# EAGLE schematic Motherboard (EAGLE 6.5.0)

## Sheet 1 of 7: Power
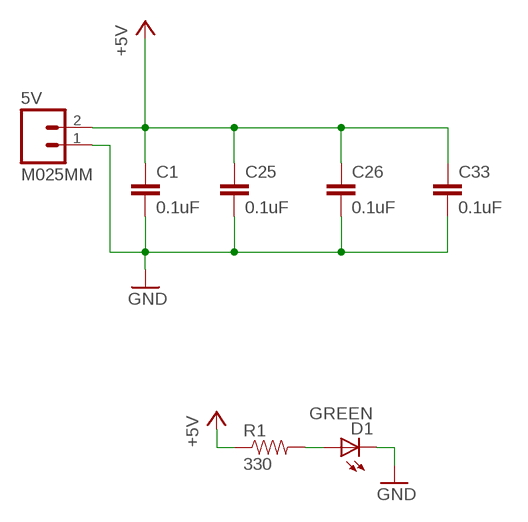
[diagram p0: schematic, sheet 1]

### Parts
5V  M025MM  [SCREWTERMINAL-5MM-2]
C1  0.1uF  CAP1206  [1206]
C25  0.1uF  CAP1206  [1206]
C26  0.1uF  CAP1206  [1206]
C33  0.1uF  CAP1206  [1206]
D1  GREEN  LED-GREENLARGE  [LED-1206]
R1  330  RESISTOR1206  [1206]

### Nets
+5V: 5V.2 C1.1 C25.1 C26.1 C33.1 R1.1 ; also sheet 3,4,6
GND: 5V.1 C1.2 C25.2 C26.2 C33.2 D1.C ; also sheet 2,3,4,5,6
N$45: D1.A R1.2

## Sheet 2 of 7: Fans
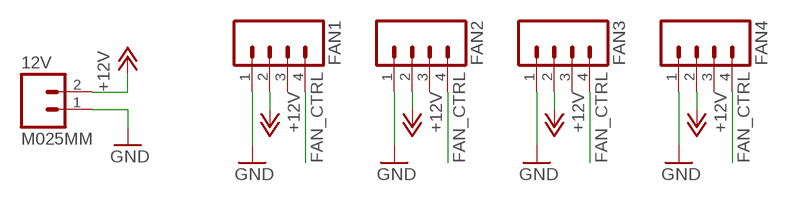
[diagram p1: schematic, sheet 2]

### Parts
12V  M025MM  [SCREWTERMINAL-5MM-2]
FAN1  M04LONGPADS  [1X04_LONGPADS]
FAN2  M04LONGPADS  [1X04_LONGPADS]
FAN3  M04LONGPADS  [1X04_LONGPADS]
FAN4  M04LONGPADS  [1X04_LONGPADS]

### Nets
+12V: 12V.2 FAN1.2 FAN2.2 FAN3.2 FAN4.2
FAN_CTRL: FAN1.4 FAN2.4 FAN3.4 FAN4.4 ; also sheet 3
GND: 12V.1 FAN1.1 FAN2.1 FAN3.1 FAN4.1 ; also sheet 1,3,4,5,6
Unconnected: FAN1.3 FAN2.3 FAN3.3 FAN4.3

## Sheet 3 of 7: Launchpad
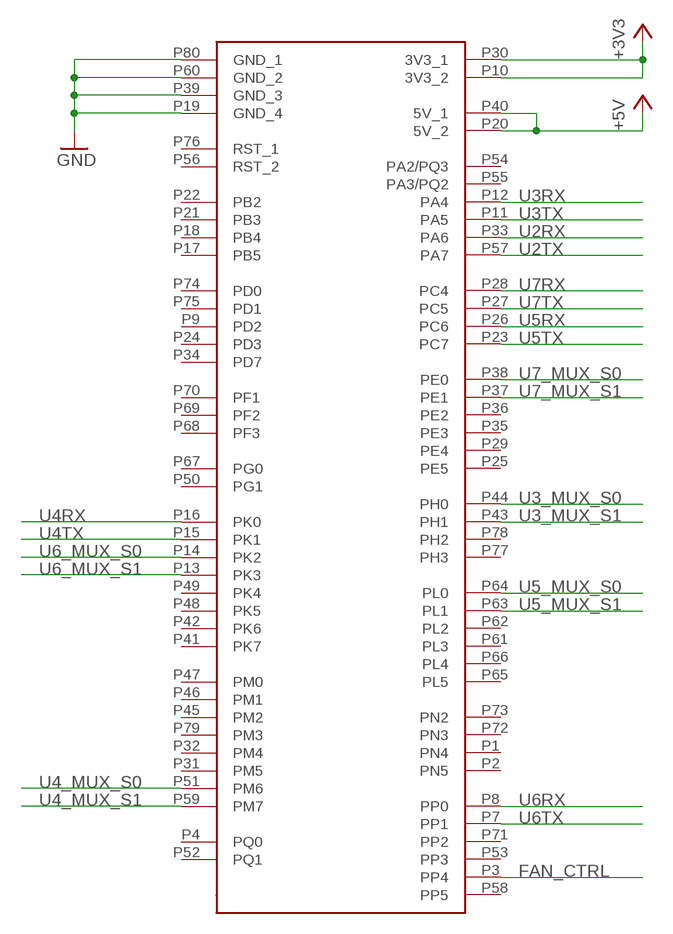
[diagram p2: schematic, sheet 3]

### Parts
U$5  STELLARISLAUNCHPAD_CONNECTED  [STELLARISLAUNCHPAD_CONNECTED]

### Nets
+3V3: U$5.P10(3V3_2) U$5.P30(3V3_1) ; also sheet 5,6
+5V: U$5.P20(5V_2) U$5.P40(5V_1) ; also sheet 1,4,6
FAN_CTRL: U$5.P3(PP4) ; also sheet 2
GND: U$5.P19(GND_4) U$5.P39(GND_3) U$5.P60(GND_2) U$5.P80(GND_1) ; also sheet 1,2,4,5,6
U2RX: U$5.P33(PA6) ; also sheet 6
U2TX: U$5.P57(PA7) ; also sheet 6
U3_MUX_S0: U$5.P44(PH0) ; also sheet 4
U3_MUX_S1: U$5.P43(PH1) ; also sheet 4
U3RX: U$5.P12(PA4) ; also sheet 4
U3TX: U$5.P11(PA5) ; also sheet 4
U4_MUX_S0: U$5.P51(PM6) ; also sheet 4
U4_MUX_S1: U$5.P59(PM7) ; also sheet 4
U4RX: U$5.P16(PK0) ; also sheet 4
U4TX: U$5.P15(PK1) ; also sheet 4
U5_MUX_S0: U$5.P64(PL0) ; also sheet 4
U5_MUX_S1: U$5.P63(PL1) ; also sheet 4
U5RX: U$5.P26(PC6) ; also sheet 4
U5TX: U$5.P23(PC7) ; also sheet 4
U6_MUX_S0: U$5.P14(PK2) ; also sheet 4
U6_MUX_S1: U$5.P13(PK3) ; also sheet 4
U6RX: U$5.P8(PP0) ; also sheet 4
U6TX: U$5.P7(PP1) ; also sheet 4
U7_MUX_S0: U$5.P38(PE0) ; also sheet 4
U7_MUX_S1: U$5.P37(PE1) ; also sheet 4
U7RX: U$5.P28(PC4) ; also sheet 4
U7TX: U$5.P27(PC5) ; also sheet 4
Unconnected: U$5.P1(PN4) U$5.P2(PN5) U$5.P4(PQ0) U$5.P9(PD2) U$5.P17(PB5) U$5.P18(PB4) U$5.P21(PB3) U$5.P22(PB2) U$5.P24(PD3) U$5.P25(PE5) U$5.P29(PE4) U$5.P31(PM5) U$5.P32(PM4) U$5.P34(PD7) U$5.P35(PE3) U$5.P36(PE2) U$5.P41(PK7) U$5.P42(PK6) U$5.P45(PM2) U$5.P46(PM1) U$5.P47(PM0) U$5.P48(PK5) U$5.P49(PK4) U$5.P50(PG1) U$5.P52(PQ1) U$5.P53(PP3) U$5.P54(PA2/PQ3) U$5.P55(PA3/PQ2) U$5.P56(RST_2) U$5.P58(PP5) U$5.P61(PL3) U$5.P62(PL2) U$5.P65(PL5) U$5.P66(PL4) U$5.P67(PG0) U$5.P68(PF3) U$5.P69(PF2) U$5.P70(PF1) U$5.P71(PP2) U$5.P72(PN3) U$5.P73(PN2) U$5.P74(PD0) U$5.P75(PD1) U$5.P76(RST_1) U$5.P77(PH3) U$5.P78(PH2) U$5.P79(PM3)

## Sheet 4 of 7: Muxes
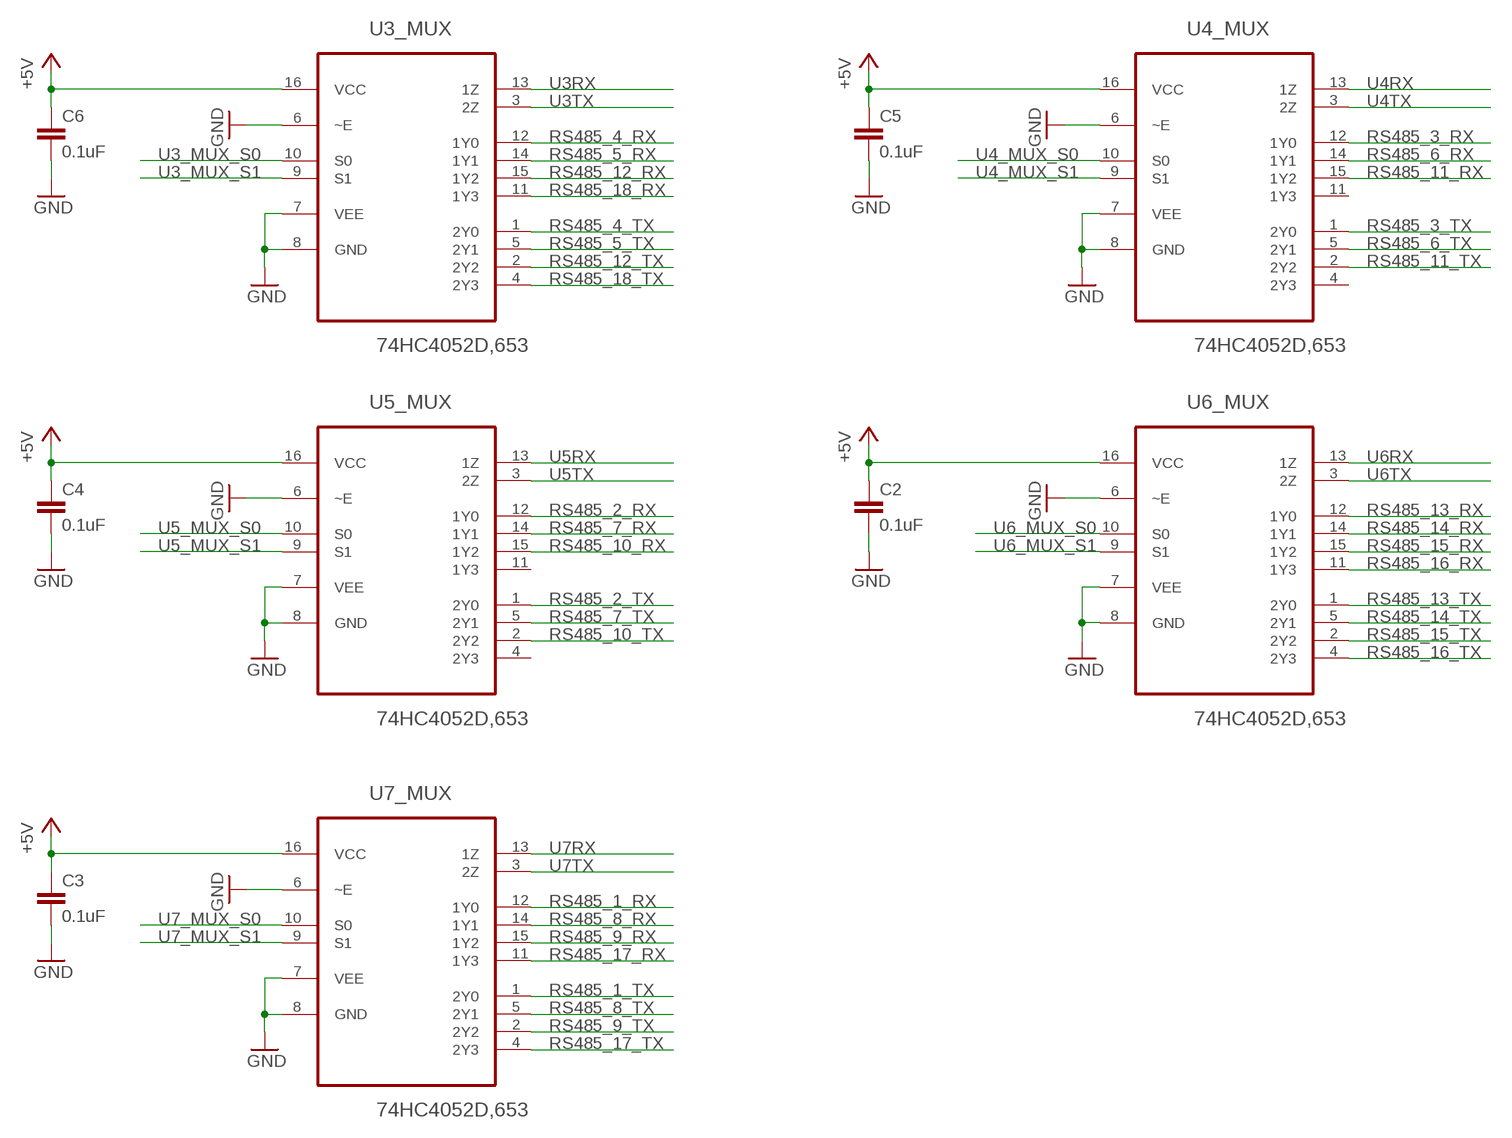
[diagram p3: schematic, sheet 4]

### Parts
C2  0.1uF  CAP1206  [1206]
C3  0.1uF  CAP1206  [1206]
C4  0.1uF  CAP1206  [1206]
C5  0.1uF  CAP1206  [1206]
C6  0.1uF  CAP1206  [1206]
U3_MUX  74HC4052D,653  [SOIC127P600X175-16N]
U4_MUX  74HC4052D,653  [SOIC127P600X175-16N]
U5_MUX  74HC4052D,653  [SOIC127P600X175-16N]
U6_MUX  74HC4052D,653  [SOIC127P600X175-16N]
U7_MUX  74HC4052D,653  [SOIC127P600X175-16N]

### Nets
+5V: C2.1 C3.1 C4.1 C5.1 C6.1 U3_MUX.16(VCC) U4_MUX.16(VCC) U5_MUX.16(VCC) U6_MUX.16(VCC) U7_MUX.16(VCC) ; also sheet 1,3,6
GND: C2.2 C3.2 C4.2 C5.2 C6.2 U3_MUX.6(~E) U3_MUX.7(VEE) U3_MUX.8(GND) U4_MUX.6(~E) U4_MUX.7(VEE) U4_MUX.8(GND) U5_MUX.6(~E) U5_MUX.7(VEE) U5_MUX.8(GND) U6_MUX.6(~E) U6_MUX.7(VEE) U6_MUX.8(GND) U7_MUX.6(~E) U7_MUX.7(VEE) U7_MUX.8(GND) ; also sheet 1,2,3,5,6
RS485_1_RX: U7_MUX.12(1Y0) ; also sheet 5
RS485_1_TX: U7_MUX.1(2Y0) ; also sheet 5
RS485_2_RX: U5_MUX.12(1Y0) ; also sheet 5
RS485_2_TX: U5_MUX.1(2Y0) ; also sheet 5
RS485_3_RX: U4_MUX.12(1Y0) ; also sheet 5
RS485_3_TX: U4_MUX.1(2Y0) ; also sheet 5
RS485_4_RX: U3_MUX.12(1Y0) ; also sheet 5
RS485_4_TX: U3_MUX.1(2Y0) ; also sheet 5
RS485_5_RX: U3_MUX.14(1Y1) ; also sheet 5
RS485_5_TX: U3_MUX.5(2Y1) ; also sheet 5
RS485_6_RX: U4_MUX.14(1Y1) ; also sheet 5
RS485_6_TX: U4_MUX.5(2Y1) ; also sheet 5
RS485_7_RX: U5_MUX.14(1Y1) ; also sheet 5
RS485_7_TX: U5_MUX.5(2Y1) ; also sheet 5
RS485_8_RX: U7_MUX.14(1Y1) ; also sheet 5
RS485_8_TX: U7_MUX.5(2Y1) ; also sheet 5
RS485_9_RX: U7_MUX.15(1Y2) ; also sheet 5
RS485_9_TX: U7_MUX.2(2Y2) ; also sheet 5
RS485_10_RX: U5_MUX.15(1Y2) ; also sheet 5
RS485_10_TX: U5_MUX.2(2Y2) ; also sheet 5
RS485_11_RX: U4_MUX.15(1Y2) ; also sheet 5
RS485_11_TX: U4_MUX.2(2Y2) ; also sheet 5
RS485_12_RX: U3_MUX.15(1Y2) ; also sheet 5
RS485_12_TX: U3_MUX.2(2Y2) ; also sheet 5
RS485_13_RX: U6_MUX.12(1Y0) ; also sheet 5
RS485_13_TX: U6_MUX.1(2Y0) ; also sheet 5
RS485_14_RX: U6_MUX.14(1Y1) ; also sheet 5
RS485_14_TX: U6_MUX.5(2Y1) ; also sheet 5
RS485_15_RX: U6_MUX.15(1Y2) ; also sheet 5
RS485_15_TX: U6_MUX.2(2Y2) ; also sheet 5
RS485_16_RX: U6_MUX.11(1Y3) ; also sheet 5
RS485_16_TX: U6_MUX.4(2Y3) ; also sheet 5
RS485_17_RX: U7_MUX.11(1Y3) ; also sheet 5
RS485_17_TX: U7_MUX.4(2Y3) ; also sheet 5
RS485_18_RX: U3_MUX.11(1Y3) ; also sheet 5
RS485_18_TX: U3_MUX.4(2Y3) ; also sheet 5
U3_MUX_S0: U3_MUX.10(S0) ; also sheet 3
U3_MUX_S1: U3_MUX.9(S1) ; also sheet 3
U3RX: U3_MUX.13(1Z) ; also sheet 3
U3TX: U3_MUX.3(2Z) ; also sheet 3
U4_MUX_S0: U4_MUX.10(S0) ; also sheet 3
U4_MUX_S1: U4_MUX.9(S1) ; also sheet 3
U4RX: U4_MUX.13(1Z) ; also sheet 3
U4TX: U4_MUX.3(2Z) ; also sheet 3
U5_MUX_S0: U5_MUX.10(S0) ; also sheet 3
U5_MUX_S1: U5_MUX.9(S1) ; also sheet 3
U5RX: U5_MUX.13(1Z) ; also sheet 3
U5TX: U5_MUX.3(2Z) ; also sheet 3
U6_MUX_S0: U6_MUX.10(S0) ; also sheet 3
U6_MUX_S1: U6_MUX.9(S1) ; also sheet 3
U6RX: U6_MUX.13(1Z) ; also sheet 3
U6TX: U6_MUX.3(2Z) ; also sheet 3
U7_MUX_S0: U7_MUX.10(S0) ; also sheet 3
U7_MUX_S1: U7_MUX.9(S1) ; also sheet 3
U7RX: U7_MUX.13(1Z) ; also sheet 3
U7TX: U7_MUX.3(2Z) ; also sheet 3
Unconnected: U4_MUX.4(2Y3) U4_MUX.11(1Y3) U5_MUX.4(2Y3) U5_MUX.11(1Y3)

## Sheet 5 of 7: RS-485 External
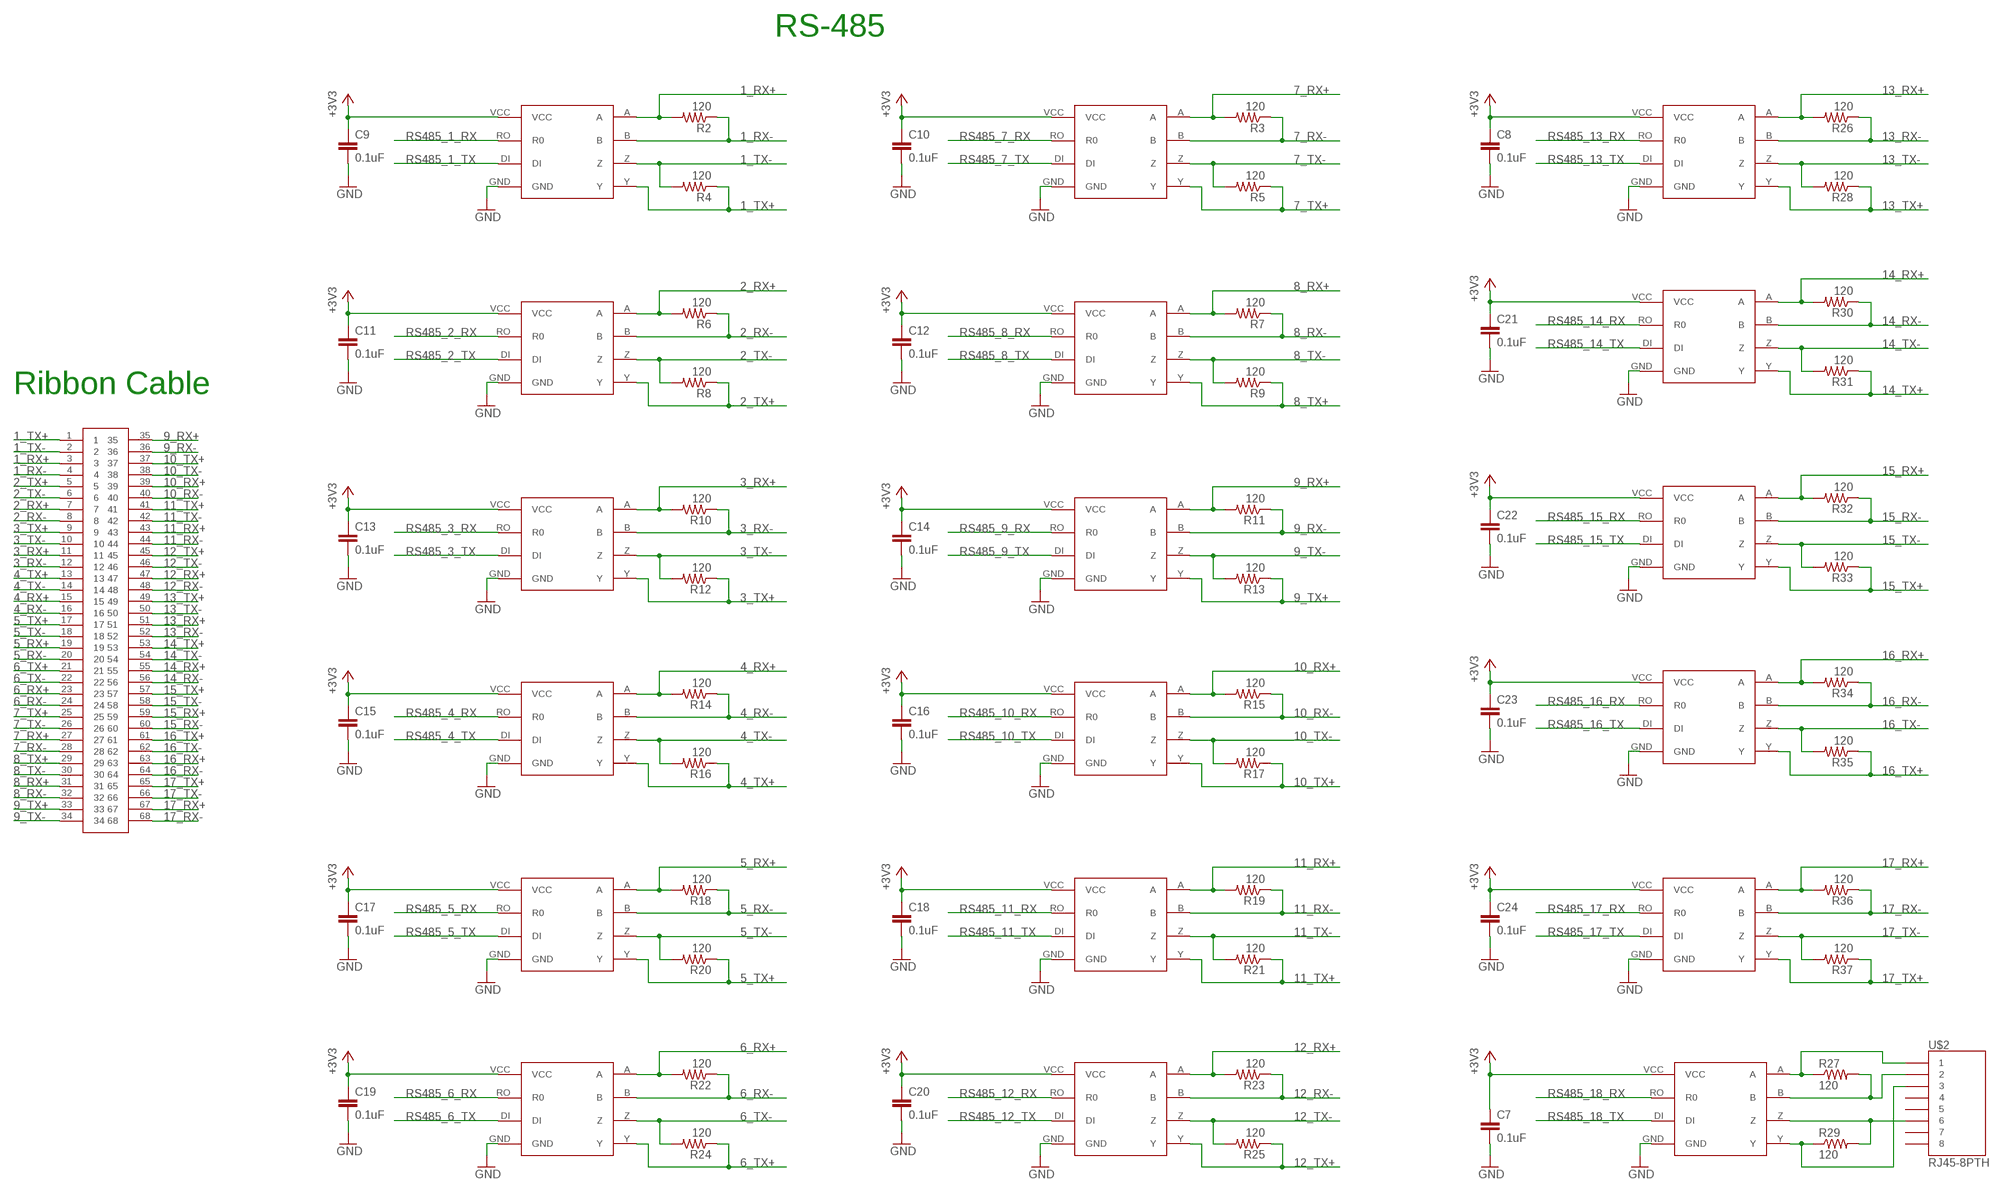
[diagram p4: schematic, sheet 5]

### Parts
C7  0.1uF  CAP1206  [1206]
C8  0.1uF  CAP1206  [1206]
C9  0.1uF  CAP1206  [1206]
C10  0.1uF  CAP1206  [1206]
C11  0.1uF  CAP1206  [1206]
C12  0.1uF  CAP1206  [1206]
C13  0.1uF  CAP1206  [1206]
C14  0.1uF  CAP1206  [1206]
C15  0.1uF  CAP1206  [1206]
C16  0.1uF  CAP1206  [1206]
C17  0.1uF  CAP1206  [1206]
C18  0.1uF  CAP1206  [1206]
C19  0.1uF  CAP1206  [1206]
C20  0.1uF  CAP1206  [1206]
C21  0.1uF  CAP1206  [1206]
C22  0.1uF  CAP1206  [1206]
C23  0.1uF  CAP1206  [1206]
C24  0.1uF  CAP1206  [1206]
R2  120  RESISTOR1206  [1206]
R3  120  RESISTOR1206  [1206]
R4  120  RESISTOR1206  [1206]
R5  120  RESISTOR1206  [1206]
R6  120  RESISTOR1206  [1206]
R7  120  RESISTOR1206  [1206]
R8  120  RESISTOR1206  [1206]
R9  120  RESISTOR1206  [1206]
R10  120  RESISTOR1206  [1206]
R11  120  RESISTOR1206  [1206]
R12  120  RESISTOR1206  [1206]
R13  120  RESISTOR1206  [1206]
R14  120  RESISTOR1206  [1206]
R15  120  RESISTOR1206  [1206]
R16  120  RESISTOR1206  [1206]
R17  120  RESISTOR1206  [1206]
R18  120  RESISTOR1206  [1206]
R19  120  RESISTOR1206  [1206]
R20  120  RESISTOR1206  [1206]
R21  120  RESISTOR1206  [1206]
R22  120  RESISTOR1206  [1206]
R23  120  RESISTOR1206  [1206]
R24  120  RESISTOR1206  [1206]
R25  120  RESISTOR1206  [1206]
R26  120  RESISTOR1206  [1206]
R27  120  RESISTOR1206  [1206]
R28  120  RESISTOR1206  [1206]
R29  120  RESISTOR1206  [1206]
R30  120  RESISTOR1206  [1206]
R31  120  RESISTOR1206  [1206]
R32  120  RESISTOR1206  [1206]
R33  120  RESISTOR1206  [1206]
R34  120  RESISTOR1206  [1206]
R35  120  RESISTOR1206  [1206]
R36  120  RESISTOR1206  [1206]
R37  120  RESISTOR1206  [1206]
RS-485-2  MAX3077  [MAX3070E]
RS_TRANS_1  MAX3077  [MAX3070E]
RS_TRANS_2  MAX3077  [MAX3070E]
RS_TRANS_3  MAX3077  [MAX3070E]
RS_TRANS_4  MAX3077  [MAX3070E]
RS_TRANS_5  MAX3077  [MAX3070E]
RS_TRANS_6  MAX3077  [MAX3070E]
RS_TRANS_7  MAX3077  [MAX3070E]
RS_TRANS_8  MAX3077  [MAX3070E]
RS_TRANS_9  MAX3077  [MAX3070E]
RS_TRANS_10  MAX3077  [MAX3070E]
RS_TRANS_11  MAX3077  [MAX3070E]
RS_TRANS_12  MAX3077  [MAX3070E]
RS_TRANS_13  MAX3077  [MAX3070E]
RS_TRANS_14  MAX3077  [MAX3070E]
RS_TRANS_15  MAX3077  [MAX3070E]
RS_TRANS_16  MAX3077  [MAX3070E]
RS_TRANS_17  MAX3077  [MAX3070E]
U$2  RJ45-8PTH  [RJ45-8]
U$4  TB60050685100  [60050685100]

### Nets
1_RX+: R2.2 RS_TRANS_1.A U$4.3
1_RX-: R2.1 RS_TRANS_1.B U$4.4
1_TX+: R4.1 RS_TRANS_1.Y U$4.1
1_TX-: R4.2 RS_TRANS_1.Z U$4.2
2_RX+: R6.2 RS_TRANS_3.A U$4.7
2_RX-: R6.1 RS_TRANS_3.B U$4.8
2_TX+: R8.1 RS_TRANS_3.Y U$4.5
2_TX-: R8.2 RS_TRANS_3.Z U$4.6
3_RX+: R10.2 RS_TRANS_5.A U$4.11
3_RX-: R10.1 RS_TRANS_5.B U$4.12
3_TX+: R12.1 RS_TRANS_5.Y U$4.9
3_TX-: R12.2 RS_TRANS_5.Z U$4.10
4_RX+: R14.2 RS_TRANS_7.A U$4.15
4_RX-: R14.1 RS_TRANS_7.B U$4.16
4_TX+: R16.1 RS_TRANS_7.Y U$4.13
4_TX-: R16.2 RS_TRANS_7.Z U$4.14
5_RX+: R18.2 RS_TRANS_9.A U$4.19
5_RX-: R18.1 RS_TRANS_9.B U$4.20
5_TX+: R20.1 RS_TRANS_9.Y U$4.17
5_TX-: R20.2 RS_TRANS_9.Z U$4.18
6_RX+: R22.2 RS_TRANS_11.A U$4.23
6_RX-: R22.1 RS_TRANS_11.B U$4.24
6_TX+: R24.1 RS_TRANS_11.Y U$4.21
6_TX-: R24.2 RS_TRANS_11.Z U$4.22
7_RX+: R3.2 RS_TRANS_2.A U$4.27
7_RX-: R3.1 RS_TRANS_2.B U$4.28
7_TX+: R5.1 RS_TRANS_2.Y U$4.25
7_TX-: R5.2 RS_TRANS_2.Z U$4.26
8_RX+: R7.2 RS_TRANS_4.A U$4.31
8_RX-: R7.1 RS_TRANS_4.B U$4.32
8_TX+: R9.1 RS_TRANS_4.Y U$4.29
8_TX-: R9.2 RS_TRANS_4.Z U$4.30
9_RX+: R11.2 RS_TRANS_6.A U$4.35
9_RX-: R11.1 RS_TRANS_6.B U$4.36
9_TX+: R13.1 RS_TRANS_6.Y U$4.33
9_TX-: R13.2 RS_TRANS_6.Z U$4.34
10_RX+: R15.2 RS_TRANS_8.A U$4.39
10_RX-: R15.1 RS_TRANS_8.B U$4.40
10_TX+: R17.1 RS_TRANS_8.Y U$4.37
10_TX-: R17.2 RS_TRANS_8.Z U$4.38
11_RX+: R19.2 RS_TRANS_10.A U$4.43
11_RX-: R19.1 RS_TRANS_10.B U$4.44
11_TX+: R21.1 RS_TRANS_10.Y U$4.41
11_TX-: R21.2 RS_TRANS_10.Z U$4.42
12_RX+: R23.2 RS_TRANS_12.A U$4.47
12_RX-: R23.1 RS_TRANS_12.B U$4.48
12_TX+: R25.1 RS_TRANS_12.Y U$4.45
12_TX-: R25.2 RS_TRANS_12.Z U$4.46
13_RX+: R26.2 RS_TRANS_13.A U$4.51
13_RX-: R26.1 RS_TRANS_13.B U$4.52
13_TX+: R28.1 RS_TRANS_13.Y U$4.49
13_TX-: R28.2 RS_TRANS_13.Z U$4.50
14_RX+: R30.2 RS_TRANS_14.A U$4.55
14_RX-: R30.1 RS_TRANS_14.B U$4.56
14_TX+: R31.1 RS_TRANS_14.Y U$4.53
14_TX-: R31.2 RS_TRANS_14.Z U$4.54
15_RX+: R32.2 RS_TRANS_15.A U$4.59
15_RX-: R32.1 RS_TRANS_15.B U$4.60
15_TX+: R33.1 RS_TRANS_15.Y U$4.57
15_TX-: R33.2 RS_TRANS_15.Z U$4.58
16_RX+: R34.2 RS_TRANS_16.A U$4.63
16_RX-: R34.1 RS_TRANS_16.B U$4.64
16_TX+: R35.1 RS_TRANS_16.Y U$4.61
16_TX-: R35.2 RS_TRANS_16.Z U$4.62
17_RX+: R36.2 RS_TRANS_17.A U$4.67
17_RX-: R36.1 RS_TRANS_17.B U$4.68
17_TX+: R37.1 RS_TRANS_17.Y U$4.65
17_TX-: R37.2 RS_TRANS_17.Z U$4.66
+3V3: C7.1 C8.1 C9.1 C10.1 C11.1 C12.1 C13.1 C14.1 C15.1 C16.1 C17.1 C18.1 C19.1 C20.1 C21.1 C22.1 C23.1 C24.1 RS-485-2.VCC RS_TRANS_1.VCC RS_TRANS_2.VCC RS_TRANS_3.VCC RS_TRANS_4.VCC RS_TRANS_5.VCC RS_TRANS_6.VCC RS_TRANS_7.VCC RS_TRANS_8.VCC RS_TRANS_9.VCC RS_TRANS_10.VCC RS_TRANS_11.VCC RS_TRANS_12.VCC RS_TRANS_13.VCC RS_TRANS_14.VCC RS_TRANS_15.VCC RS_TRANS_16.VCC RS_TRANS_17.VCC ; also sheet 3,6
GND: C7.2 C8.2 C9.2 C10.2 C11.2 C12.2 C13.2 C14.2 C15.2 C16.2 C17.2 C18.2 C19.2 C20.2 C21.2 C22.2 C23.2 C24.2 RS-485-2.GND RS_TRANS_1.GND RS_TRANS_2.GND RS_TRANS_3.GND RS_TRANS_4.GND RS_TRANS_5.GND RS_TRANS_6.GND RS_TRANS_7.GND RS_TRANS_8.GND RS_TRANS_9.GND RS_TRANS_10.GND RS_TRANS_11.GND RS_TRANS_12.GND RS_TRANS_13.GND RS_TRANS_14.GND RS_TRANS_15.GND RS_TRANS_16.GND RS_TRANS_17.GND ; also sheet 1,2,3,4,6
N$7: R29.2 RS-485-2.Z U$2.6
N$8: R27.1 RS-485-2.A U$2.1
N$10: R27.2 RS-485-2.B U$2.2
N$11: R29.1 RS-485-2.Y U$2.3
RS485_1_RX: RS_TRANS_1.RO(R0) ; also sheet 4
RS485_1_TX: RS_TRANS_1.DI ; also sheet 4
RS485_2_RX: RS_TRANS_3.RO(R0) ; also sheet 4
RS485_2_TX: RS_TRANS_3.DI ; also sheet 4
RS485_3_RX: RS_TRANS_5.RO(R0) ; also sheet 4
RS485_3_TX: RS_TRANS_5.DI ; also sheet 4
RS485_4_RX: RS_TRANS_7.RO(R0) ; also sheet 4
RS485_4_TX: RS_TRANS_7.DI ; also sheet 4
RS485_5_RX: RS_TRANS_9.RO(R0) ; also sheet 4
RS485_5_TX: RS_TRANS_9.DI ; also sheet 4
RS485_6_RX: RS_TRANS_11.RO(R0) ; also sheet 4
RS485_6_TX: RS_TRANS_11.DI ; also sheet 4
RS485_7_RX: RS_TRANS_2.RO(R0) ; also sheet 4
RS485_7_TX: RS_TRANS_2.DI ; also sheet 4
RS485_8_RX: RS_TRANS_4.RO(R0) ; also sheet 4
RS485_8_TX: RS_TRANS_4.DI ; also sheet 4
RS485_9_RX: RS_TRANS_6.RO(R0) ; also sheet 4
RS485_9_TX: RS_TRANS_6.DI ; also sheet 4
RS485_10_RX: RS_TRANS_8.RO(R0) ; also sheet 4
RS485_10_TX: RS_TRANS_8.DI ; also sheet 4
RS485_11_RX: RS_TRANS_10.RO(R0) ; also sheet 4
RS485_11_TX: RS_TRANS_10.DI ; also sheet 4
RS485_12_RX: RS_TRANS_12.RO(R0) ; also sheet 4
RS485_12_TX: RS_TRANS_12.DI ; also sheet 4
RS485_13_RX: RS_TRANS_13.RO(R0) ; also sheet 4
RS485_13_TX: RS_TRANS_13.DI ; also sheet 4
RS485_14_RX: RS_TRANS_14.RO(R0) ; also sheet 4
RS485_14_TX: RS_TRANS_14.DI ; also sheet 4
RS485_15_RX: RS_TRANS_15.RO(R0) ; also sheet 4
RS485_15_TX: RS_TRANS_15.DI ; also sheet 4
RS485_16_RX: RS_TRANS_16.RO(R0) ; also sheet 4
RS485_16_TX: RS_TRANS_16.DI ; also sheet 4
RS485_17_RX: RS_TRANS_17.RO(R0) ; also sheet 4
RS485_17_TX: RS_TRANS_17.DI ; also sheet 4
RS485_18_RX: RS-485-2.RO(R0) ; also sheet 4
RS485_18_TX: RS-485-2.DI ; also sheet 4
Unconnected: U$2.4 U$2.5 U$2.7 U$2.8

### Notes on the sheet
- RS-485
- Ribbon Cable

## Sheet 6 of 7: Sensors
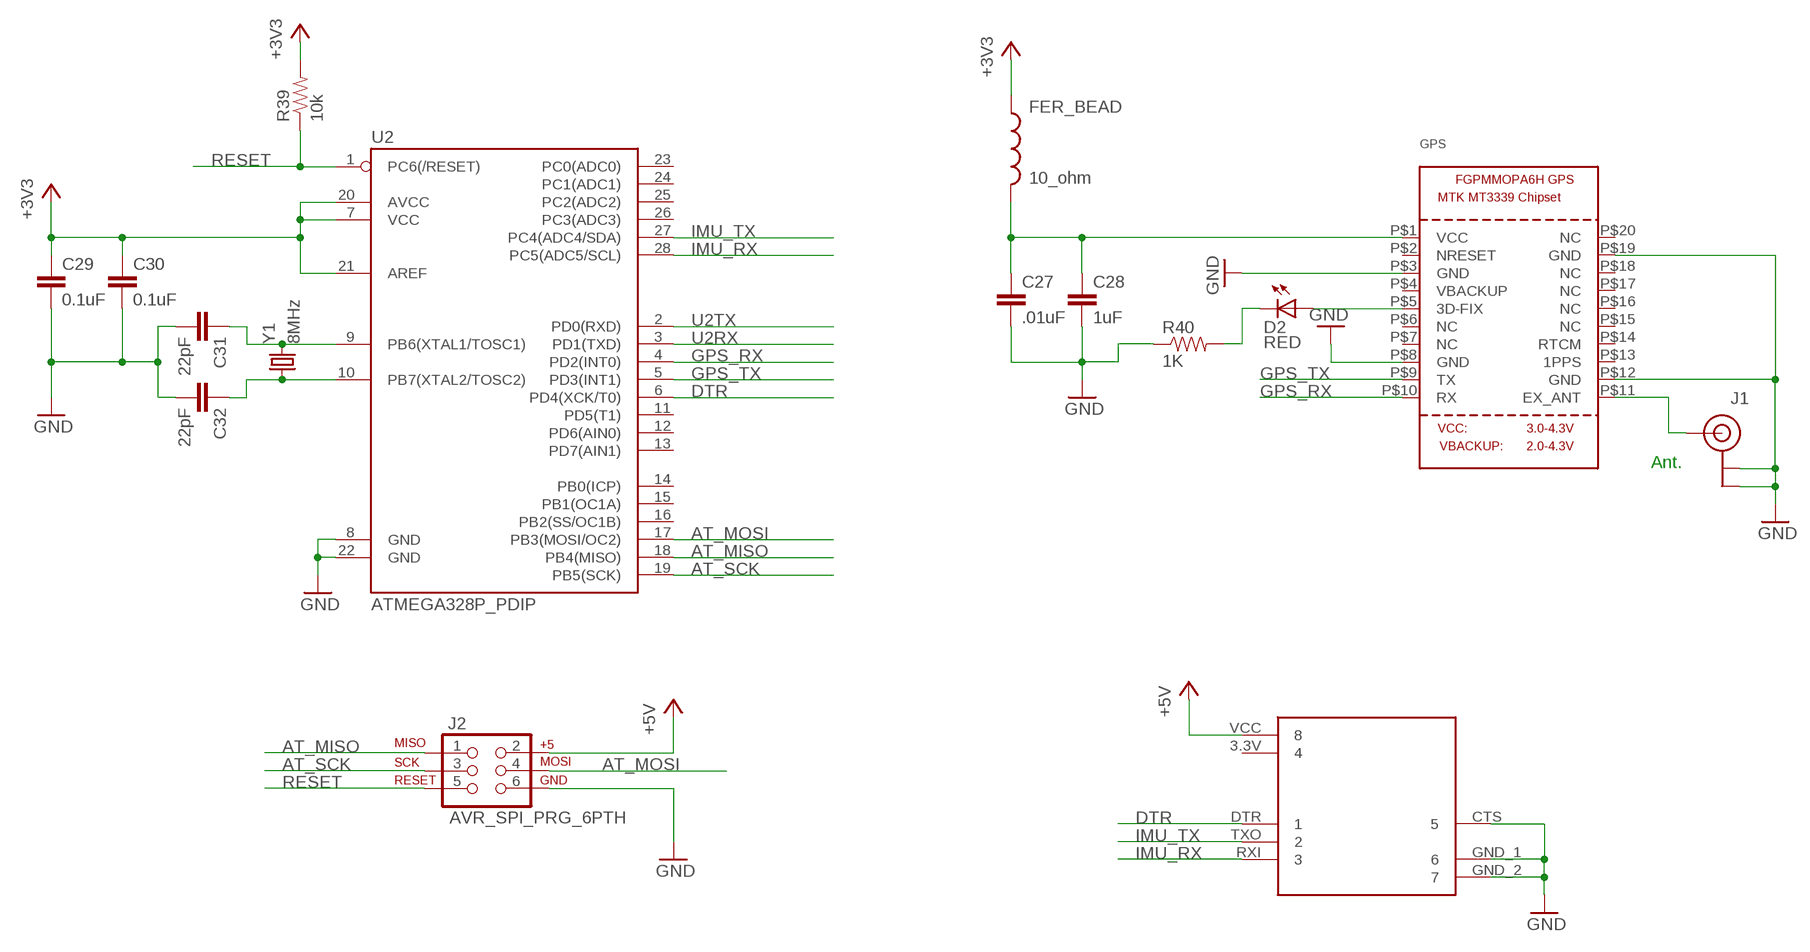
[diagram p5: schematic, sheet 6]

### Parts
C27  .01uF  CAP1206  [1206]
C28  1uF  CAP1206  [1206]
C29  0.1uF  CAP1206  [1206]
C30  0.1uF  CAP1206  [1206]
C31  22pF  CAP1206  [1206]
C32  22pF  CAP1206  [1206]
D2  RED  LED-RED1206  [LED-1206]
FER_BEAD  10_ohm  INDUCTOR30OHM,1.8A  [0603]
GPS  GPS_FGPMMOPA6H  [FGPMMOPA6H]
J1  U.FL  [U.FL]
J2  AVR_SPI_PRG_6PTH  [2X3]
R39  10k  RESISTOR1206  [1206]
R40  1K  RESISTOR1206  [1206]
U2  ATMEGA328P_PDIP  [DIL28-3]
U$1  RAZOR_IMU  [RAZOR_IMU]
Y1  8MHz  CRYSTALHC49US  [HC49US]

### Nets
+3V3: C29.1 C30.1 FER_BEAD.1 R39.2 U2.7(VCC) U2.20(AVCC) U2.21(AREF) ; also sheet 3,5
+5V: J2.2 U$1.VCC ; also sheet 1,3,4
AT_MISO: J2.1 U2.18(PB4(MISO))
AT_MOSI: J2.4 U2.17(PB3(MOSI/OC2))
AT_SCK: J2.3 U2.19(PB5(SCK))
ATCLK3: C32.1 U2.10(PB7(XTAL2/TOSC2)) Y1.1
ATCLK4: C31.1 U2.9(PB6(XTAL1/TOSC1)) Y1.2
DTR: U2.6(PD4(XCK/T0)) U$1.DTR
GND: C27.2 C28.2 C29.2 C30.2 C31.2 C32.2 GPS.P$3(GND) GPS.P$8(GND) GPS.P$12(GND) GPS.P$19(GND) J1.P$1(GND) J1.P$2(GND) J2.6 R40.1 U2.8(GND) U2.22(GND) U$1.CTS U$1.GND_1 U$1.GND_2 ; also sheet 1,2,3,4,5
GPS_RX: GPS.P$10(RX) U2.4(PD2(INT0))
GPS_TX: GPS.P$9(TX) U2.5(PD3(INT1))
IMU_RX: U2.28(PC5(ADC5/SCL)) U$1.RXI
IMU_TX: U2.27(PC4(ADC4/SDA)) U$1.TXO
N$5: GPS.P$11(EX_ANT) J1.P$3(SIGNAL)
N$6: D2.C R40.2
N$23: D2.A GPS.P$5(3D-FIX)
N$47: C27.1 C28.1 FER_BEAD.2 GPS.P$1(VCC)
RESET: J2.5 R39.1 U2.1(PC6(/RESET))
U2RX: U2.3(PD1(TXD)) ; also sheet 3
U2TX: U2.2(PD0(RXD)) ; also sheet 3
Unconnected: GPS.P$2(NRESET) GPS.P$4(VBACKUP) GPS.P$6(NC) GPS.P$7(NC) GPS.P$13(1PPS) GPS.P$14(RTCM) GPS.P$15(NC) GPS.P$16(NC) GPS.P$17(NC) GPS.P$18(NC) GPS.P$20(NC) U2.11(PD5(T1)) U2.12(PD6(AIN0)) U2.13(PD7(AIN1)) U2.14(PB0(ICP)) U2.15(PB1(OC1A)) U2.16(PB2(SS/OC1B)) U2.23(PC0(ADC0)) U2.24(PC1(ADC1)) U2.25(PC2(ADC2)) U2.26(PC3(ADC3)) U$1.3.3V

### Notes on the sheet
- Ant.

## Sheet 7 of 7: Holes
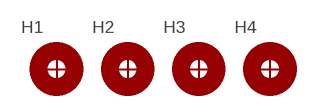
[diagram p6: schematic, sheet 7]

### Parts
H1  H_MNTHOLE_#4  [H_MNTHOLE_#4]
H2  H_MNTHOLE_#4  [H_MNTHOLE_#4]
H3  H_MNTHOLE_#4  [H_MNTHOLE_#4]
H4  H_MNTHOLE_#4  [H_MNTHOLE_#4]
Unconnected: H1.1 H2.1 H3.1 H4.1

## Library data of the parts
5V 12V = SparkFun-Connectors:M02: Standard 2-pin 0.1" header. Use with - straight break away headers ( PRT-00116) - right angle break away headers (PRT-00553) - swiss pins (PRT-00743) - machine pins (PRT-00117) - female headers (PRT-00115) Molex polarized connector foot print use with: PRT-08233 with associated crimp pins and housings. 2.54_SCREWTERM for use with PRT-10571. 3.5mm Screw Terminal footprints for PRT-08084 5mm Screw Terminal footprints for use with PRT-08433
C1-C33 = SparkFun-Passives:CAP: Capacitor Standard 0603 ceramic capacitor, and 0.1" leaded capacitor.
D1 = SparkFun-LED:LED-GREEN: Various green LEDs 0603- DIO-00821 LARGE- DIO-00862 LILYPAD- DIO-09910; PROD_ID: DIO-00862
D2 = SparkFun-LED:LED-RED: Assorted Red LEDs LilyPad 1206- DIO-09912 1206- DIO-00809 0603- DIO-00819; PROD_ID: DIO-00809
FAN1-FAN4 = SparkFun-Connectors:M04: Header 4 Standard 4-pin 0.1" header. Use with straight break away headers (SKU : PRT-00116), right angle break away headers (PRT-00553), swiss pins (PRT-00743), machine pins (PRT-00117), and female headers (PRT-00115). Molex polarized connector foot print use with SKU : PRT-08231 with associated crimp pins and housings. 1MM SMD Version SKU: PRT-10208
FER_BEAD = SparkFun-Passives:INDUCTOR: Inductors Basic Inductor/Choke - 0603 and 1206. Footprints are not proven and vary greatly between part numbers. SRN6045- 33uH, 20% 1.4A SDR0403-560KL - 56uH, 10%, 500mA RMS/740mA peak
GPS = adafruit:GPS_FGPMMOPA6H: GPS Module - MTK MT3339 Chipset, -165dBm sensitivity, 22 channels, 10Hz, auto-select external antenna options
H1-H4 = Lib_TH:H_MNTHOLE
J1 = SparkFun-Connectors:U.FL: SMD antenna connector- WRL-09144
J2 = SparkFun-Connectors:AVR_SPI_PRG_6: AVR ISP 6 Pin This is the reduced ISP connector for AVR programming. Common on Arduino. This footprint will take up less PCB space and can be used with a 10-pin to 6-pin adapter such as SKU: BOB-08508
R1-R37 R40 = SparkFun-Passives:RESISTOR: Resistor Basic schematic elements and footprints for 0603, 1206, and PTH resistors.
R39 = SparkFun-Resistors:RESISTOR: Resistor Basic schematic elements and footprints for 0603, 1206, and PTH resistors.
RS-485-2 RS_TRANS_1-RS_TRANS_17 = MAX3077:MAX3077
U2 = SparkFun-DigitalIC:ATMEGA328P_PDIP: uC used in the Arduino 32kb flash, 1k EEPROM, 2k SRAM This is the through-hole version of this chip.
U3_MUX U4_MUX U5_MUX U6_MUX U7_MUX = 4x1_Dual_Mux:74HC4052D,653: Dual 4-channel analog multiplexer/demultiplexer; MPN: 74HC4052D,653; OC_FARNELL: 1826642; OC_NEWARK: 78R7402; PACKAGE: SO-16; SUPPLIER: NXP
U$1 = imu:RAZOR_IMU
U$2 = SparkFun-Connectors:RJ45-8: RJ45 Jack Simple RJ45, 8-pin connection - connector for common Cat5, Cat5e, and Cat6 Ethernet cables. Footprint not yet proven in production. Connector sku is PRT-00643; Breakout PCB sku is BOB-00716.
U$4 = harting-scsi:TB60050685100
U$5 = StellarisLaunchPadConnected:STELLARISLAUNCHPAD_CONNECTED
Y1 = SparkFun-FreqCtrl:CRYSTAL: Various standard crystals. Proven footprints. Spark Fun Electronics SKU : COM-00534